# EAGLE design main (EAGLE 9.5.2)

## Sheet 1 of 3: Arduino and UI
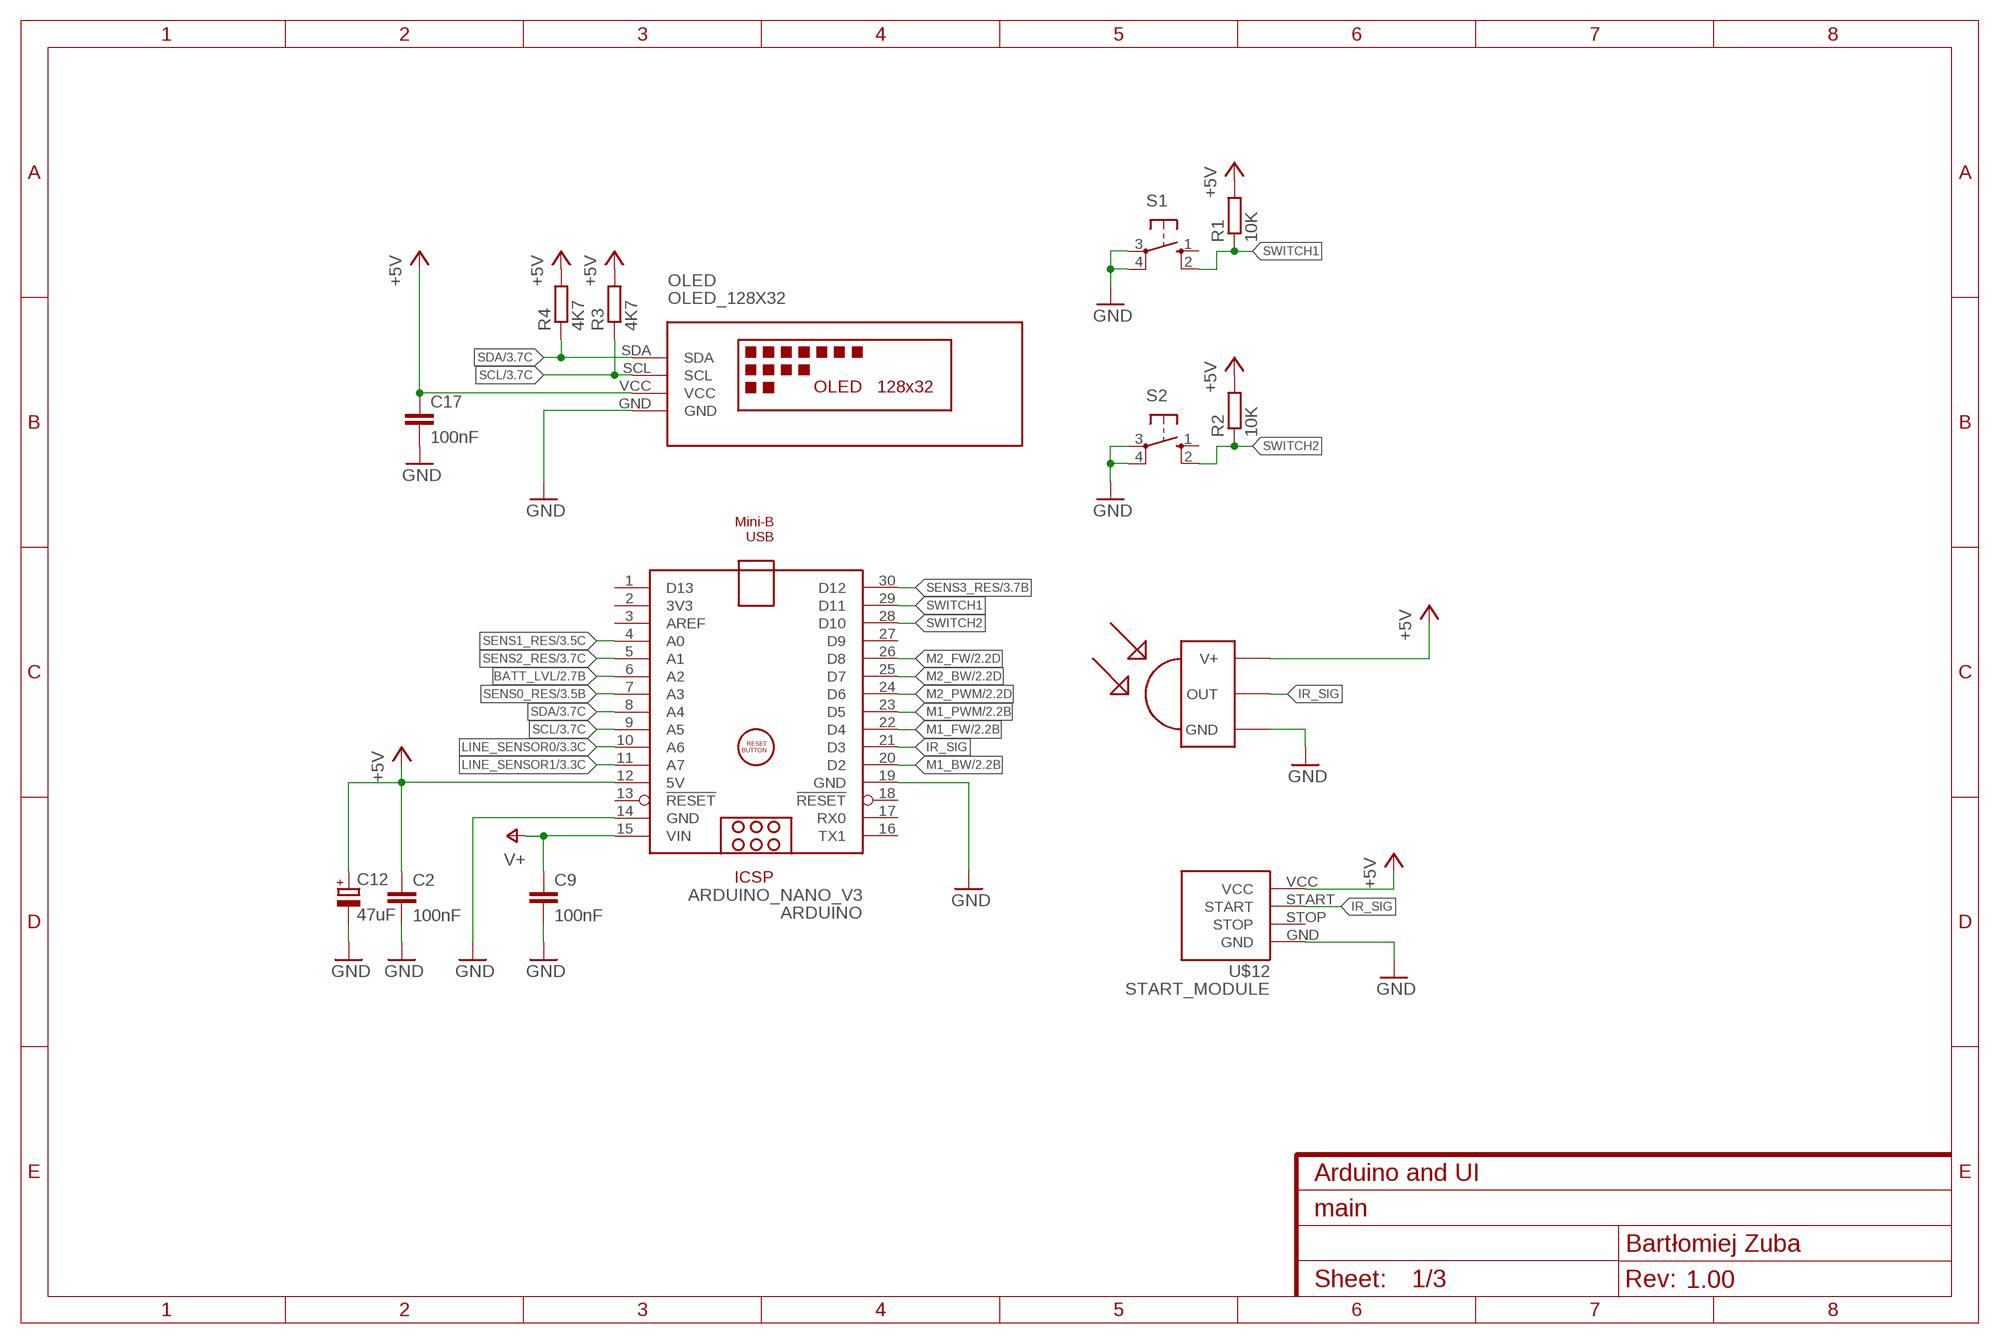
[diagram p0: schematic, sheet 1]
FRAME4 (FRAME-A4L): CNAME: Arduino and UI; CREVISION: 1.00; DESIGNER: Bartłomiej Zuba

### Parts
ARDUINO  ARDUINO_NANO_V3  [ARDUINO_NANO_V3]
C2  100nF  C-EUC0805  [C0805]
C9  100nF  C-EUC0805  [C0805]
C12  47uF  CPOL-EUE3.5-8  [E3,5-8]
C17  100nF  C-EUC0805  [C0805]
OLED  OLED_128X32  [OLED]
R1  10K  R-EU_M0805  [M0805]
R2  10K  R-EU_M0805  [M0805]
R3  4K7  R-EU_M0805  [M0805]
R4  4K7  R-EU_M0805  [M0805]
S1  10-XX  [B3F-10XX]
S2  10-XX  [B3F-10XX]
U$2  TSOP4838  [TSOP]
U$12  START_MODULE  [START_MODULE]

### Nets
+5V: ARDUINO.12(5V) C2.1 C12.+ C17.1 OLED.VCC R1.2 R2.2 R3.2 R4.2 U$2.VCC(V+) U$12.VCC ; also sheet 2,3
BATT_LVL: ARDUINO.6(A2) ; also sheet 2
GND: ARDUINO.14(GND) ARDUINO.19(GND) C2.2 C9.2 C12.- C17.2 OLED.GND S1.3(P) S1.4(P1) S2.3(P) S2.4(P1) U$2.GND U$12.GND ; also sheet 2,3
IR_SIG: ARDUINO.21(D3) U$2.OUT U$12.START
LINE_SENSOR0: ARDUINO.10(A6) ; also sheet 3
LINE_SENSOR1: ARDUINO.11(A7) ; also sheet 3
M1_BW: ARDUINO.20(D2) ; also sheet 2
M1_FW: ARDUINO.22(D4) ; also sheet 2
M1_PWM: ARDUINO.23(D5) ; also sheet 2
M2_BW: ARDUINO.25(D7) ; also sheet 2
M2_FW: ARDUINO.26(D8) ; also sheet 2
M2_PWM: ARDUINO.24(D6) ; also sheet 2
SCL: ARDUINO.9(A5) OLED.SCL R3.1 ; also sheet 3
SDA: ARDUINO.8(A4) OLED.SDA R4.1 ; also sheet 3
SENS0_RES: ARDUINO.7(A3) ; also sheet 3
SENS1_RES: ARDUINO.4(A0) ; also sheet 3
SENS2_RES: ARDUINO.5(A1) ; also sheet 3
SENS3_RES: ARDUINO.30(D12) ; also sheet 3
SWITCH1: ARDUINO.29(D11) R1.1 S1.2(S1)
SWITCH2: ARDUINO.28(D10) R2.1 S2.2(S1)
V+: ARDUINO.15(VIN) C9.1 ; also sheet 2
Unconnected: ARDUINO.1(D13) ARDUINO.2(3V3) ARDUINO.3(AREF) ARDUINO.13(!RESET) ARDUINO.16(TX1) ARDUINO.17(RX0) ARDUINO.18(!RESET) ARDUINO.27(D9) S1.1(S) S2.1(S) U$12.STOP

## Sheet 2 of 3: POWER AND H BRIDGES
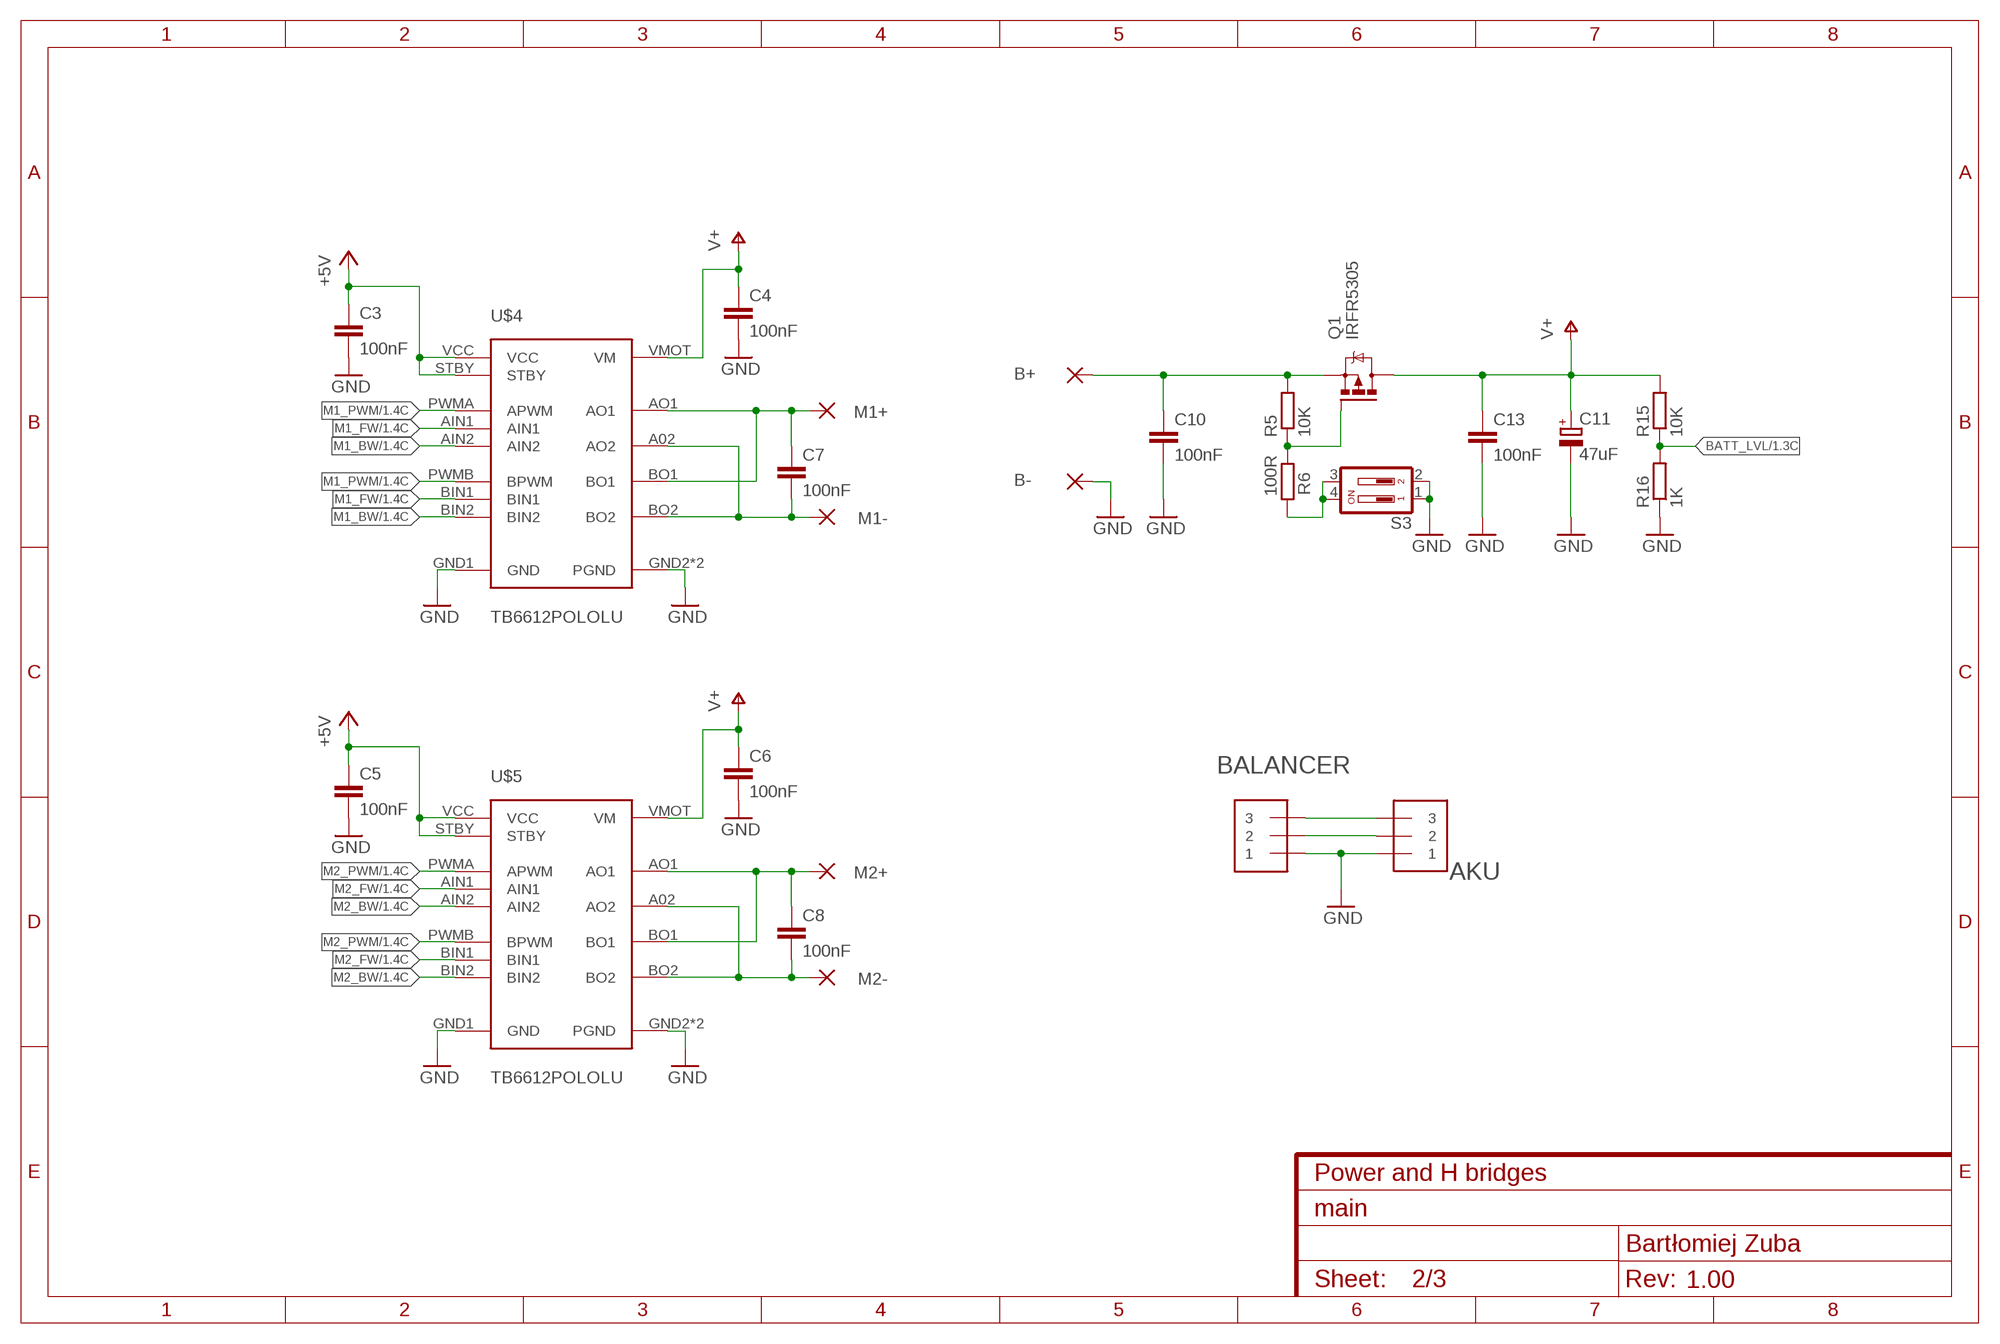
[diagram p1: schematic, sheet 2]
FRAME2 (FRAME-A4L): CNAME: Power and H bridges; CREVISION: 1.00; DESIGNER: Bartłomiej Zuba

### Parts
AKU  JST_ZH_3  [JST_ZH_3]
B+  2,54/1,0  [2,54/1,0]
B-  2,54/1,0  [2,54/1,0]
BALANCER  JST_ZH_3  [JST_ZH_3]
C3  100nF  C-EUC0805  [C0805]
C4  100nF  C-EUC0805  [C0805]
C5  100nF  C-EUC0805  [C0805]
C6  100nF  C-EUC0805  [C0805]
C7  100nF  C-EUC0805  [C0805]
C8  100nF  C-EUC0805  [C0805]
C10  100nF  C-EUC0805  [C0805]
C11  47uF  CPOL-EUE3.5-8  [E3,5-8]
C13  100nF  C-EUC0805  [C0805]
M1+  2,54/1,0  [2,54/1,0]
M1-  2,54/1,0  [2,54/1,0]
M2+  2,54/1,0  [2,54/1,0]
M2-  2,54/1,0  [2,54/1,0]
Q1  IRFR5305  [D-PAK_TO252AA]
R5  10K  R-EU_M0805  [M0805]
R6  100R  R-EU_M0805  [M0805]
R15  10K  R-EU_M0805  [M0805]
R16  1K  R-EU_M0805  [M0805]
S3  DS02  [DS-02]
U$4  TB6612POLOLU  [POLOLU]
U$5  TB6612POLOLU  [POLOLU]

### Nets
+5V: C3.1 C5.1 U$4.STBY U$4.VCC U$5.STBY U$5.VCC ; also sheet 1,3
BATT_LVL: R15.1 R16.2 ; also sheet 1
GND: AKU.P$1 B-.1(P) BALANCER.P$1 C3.2 C4.2 C5.2 C6.2 C10.2 C11.- C13.2 R16.1 S3.1 S3.2 U$4.GND1(GND) U$4.GND2(PGND) U$4.GND3(PGND) U$5.GND1(GND) U$5.GND2(PGND) U$5.GND3(PGND) ; also sheet 1,3
M1_BW: U$4.AIN2 U$4.BIN2 ; also sheet 1
M1_FW: U$4.AIN1 U$4.BIN1 ; also sheet 1
M1_PWM: U$4.PWMA(APWM) U$4.PWMB(BPWM) ; also sheet 1
M2_BW: U$5.AIN2 U$5.BIN2 ; also sheet 1
M2_FW: U$5.AIN1 U$5.BIN1 ; also sheet 1
M2_PWM: U$5.PWMA(APWM) U$5.PWMB(BPWM) ; also sheet 1
N$1: C7.1 M1+.1(P) U$4.AO1 U$4.BO1
N$2: C7.2 M1-.1(P) U$4.A02(AO2) U$4.BO2
N$3: C8.1 M2+.1(P) U$5.AO1 U$5.BO1
N$4: C8.2 M2-.1(P) U$5.A02(AO2) U$5.BO2
N$5: Q1.1(G) R5.1 R6.1
N$6: R6.2 S3.3 S3.4
N$19: AKU.P$2 BALANCER.P$2
N$20: B+.1(P) C10.1 Q1.3(S) R5.2
N$21: AKU.P$3 BALANCER.P$3
V+: C4.1 C6.1 C11.+ C13.1 Q1.4(D) R15.2 U$4.VMOT(VM) U$5.VMOT(VM) ; also sheet 1

## Sheet 3 of 3: RANGE SENSORS
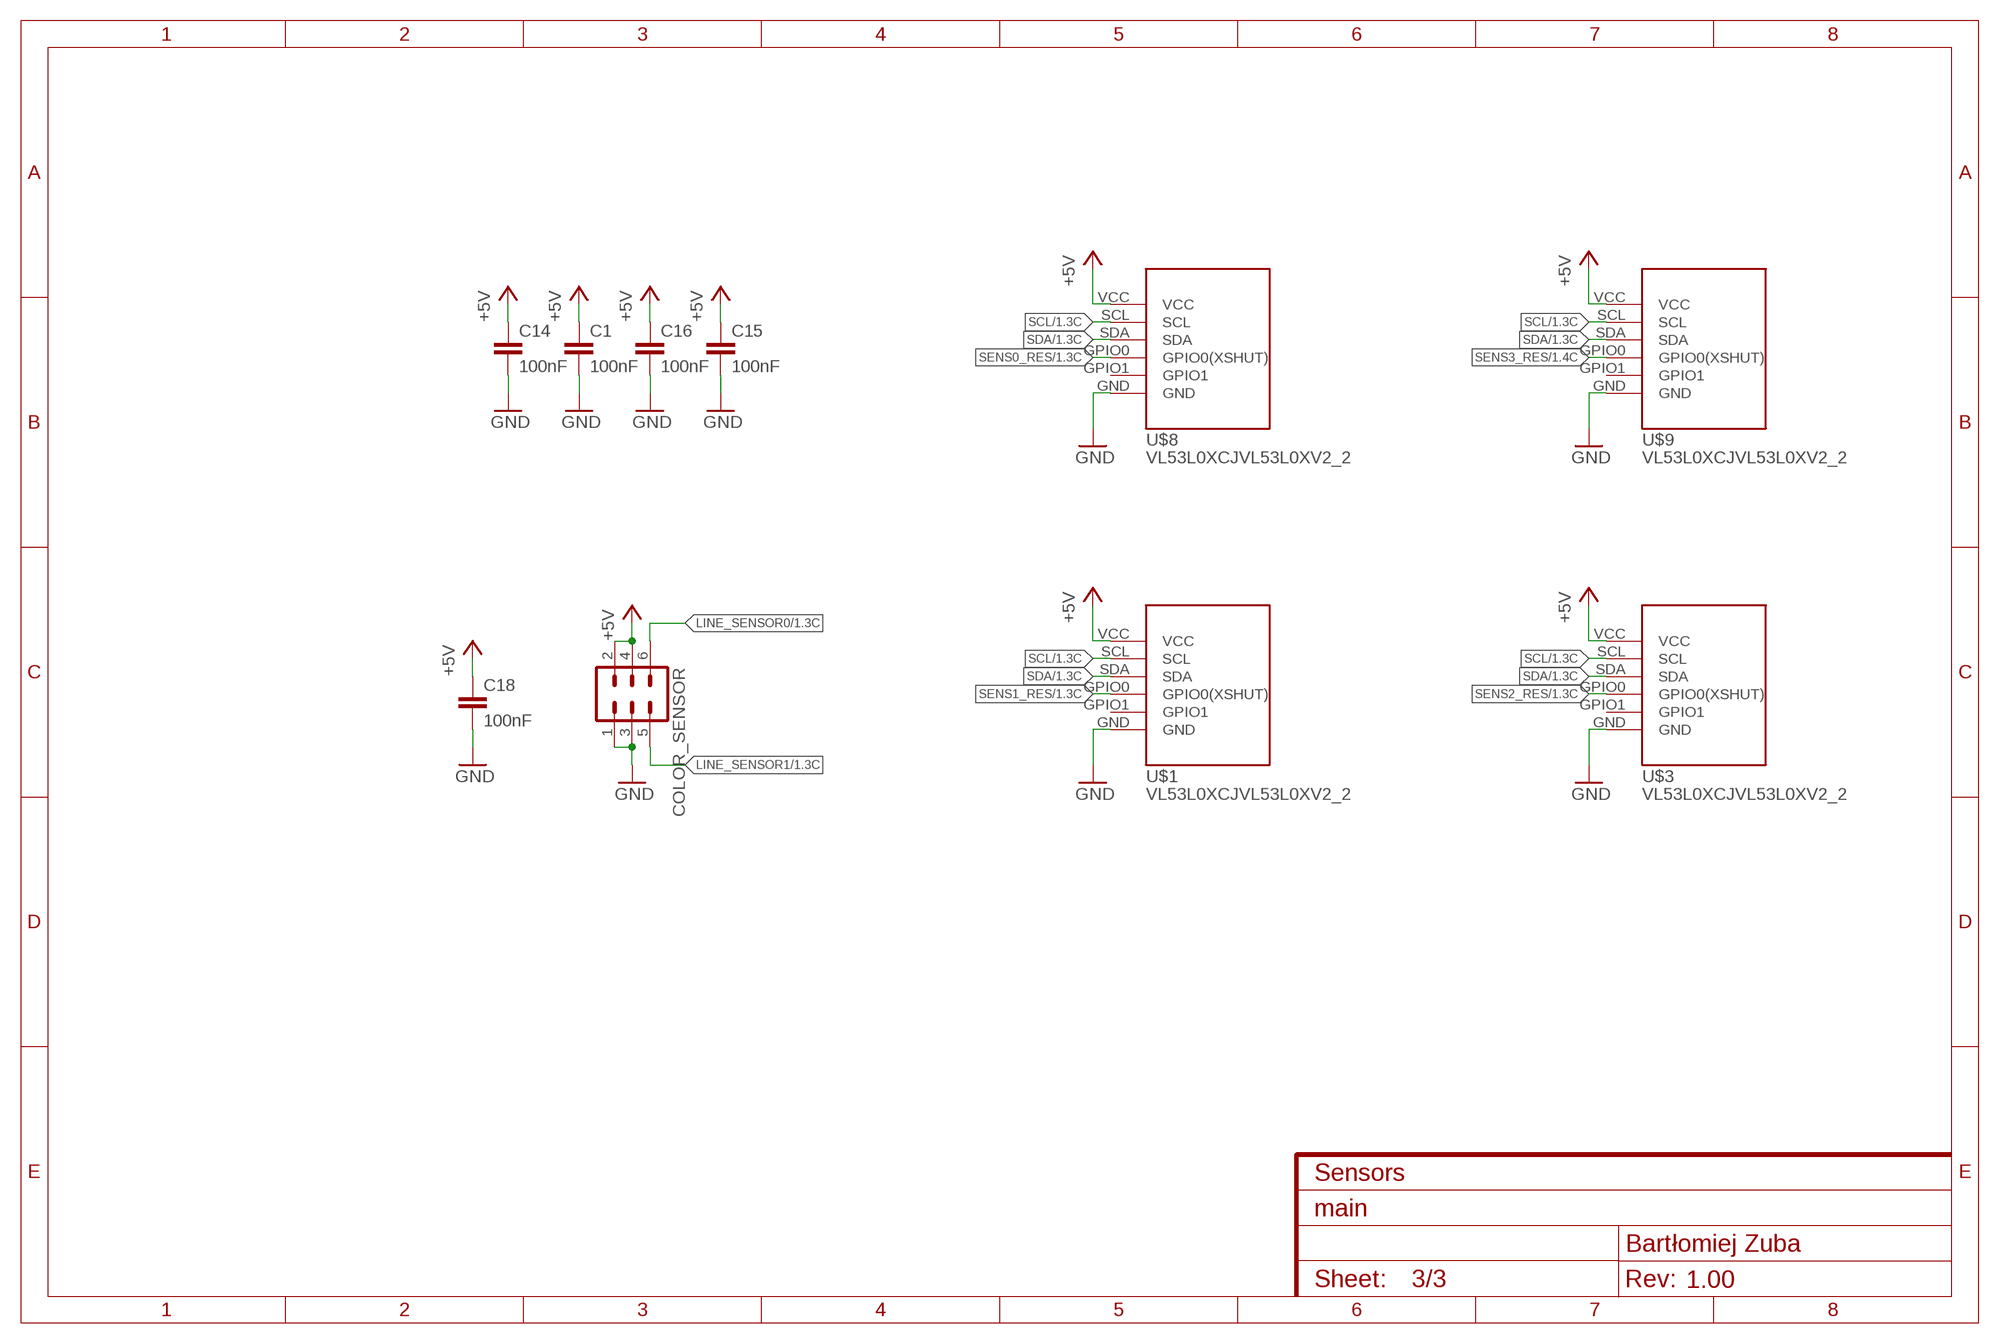
[diagram p2: schematic, sheet 3]
FRAME3 (FRAME-A4L): CNAME: Sensors; CREVISION: 1.00; DESIGNER: Bartłomiej Zuba

### Parts
C1  100nF  C-EUC0805  [C0805]
C14  100nF  C-EUC0805  [C0805]
C15  100nF  C-EUC0805  [C0805]
C16  100nF  C-EUC0805  [C0805]
C18  100nF  C-EUC0805  [C0805]
COLOR_SENSOR  MA03-2  [MA03-2]
U$1  VL53L0XCJVL53L0XV2_2  [VL53L0X_4]
U$3  VL53L0XCJVL53L0XV2_2  [VL53L0X_4]
U$8  VL53L0XCJVL53L0XV2_2  [VL53L0X_4]
U$9  VL53L0XCJVL53L0XV2_2  [VL53L0X_4]

### Nets
+5V: C1.1 C14.1 C15.1 C16.1 C18.1 COLOR_SENSOR.2 COLOR_SENSOR.4 U$1.VCC U$3.VCC U$8.VCC U$9.VCC ; also sheet 1,2
GND: C1.2 C14.2 C15.2 C16.2 C18.2 COLOR_SENSOR.1 COLOR_SENSOR.3 U$1.GND U$3.GND U$8.GND U$9.GND ; also sheet 1,2
LINE_SENSOR0: COLOR_SENSOR.6 ; also sheet 1
LINE_SENSOR1: COLOR_SENSOR.5 ; also sheet 1
SCL: U$1.SCL U$3.SCL U$8.SCL U$9.SCL ; also sheet 1
SDA: U$1.SDA U$3.SDA U$8.SDA U$9.SDA ; also sheet 1
SENS0_RES: U$8.GPIO0(GPIO0(XSHUT)) ; also sheet 1
SENS1_RES: U$1.GPIO0(GPIO0(XSHUT)) ; also sheet 1
SENS2_RES: U$3.GPIO0(GPIO0(XSHUT)) ; also sheet 1
SENS3_RES: U$9.GPIO0(GPIO0(XSHUT)) ; also sheet 1
Unconnected: U$1.GPIO1 U$3.GPIO1 U$8.GPIO1 U$9.GPIO1

## Library data of the parts
AKU BALANCER = BeagleBone_Blue_R3:JST_ZH_3
ARDUINO = ZUBA_MINISUMO:ARDUINO_NANO_V3
B+ B- M1+ M1- M2+ M2- = wirepad:2,54/1,0: THROUGH-HOLE PAD
C1-C10 C13-C18 = rcl:C-EU: CAPACITOR, European symbol; SPICEPREFIX: C
C11 C12 = rcl:CPOL-EU: POLARIZED CAPACITOR, European symbol; SPICEPREFIX: C
COLOR_SENSOR = con-lstb:MA03-2: PIN HEADER; OC_FARNELL: unknown; OC_NEWARK: unknown
OLED = ZUBA_MINISUMO:OLED_128X32
Q1 = transistor-power:IRF?5305: HEXFET Power MOSFET Source: http://www.irf.com/product-info/datasheets/data/irfr5305pbf.pdf
R1-R6 R15 R16 = rcl:R-EU_: RESISTOR, European symbol; SPICEPREFIX: R
S1 S2 = switch-omron:10-XX: OMRON SWITCH; MPN: B3F-1000; OC_FARNELL: 176432; OC_NEWARK: 36M3542
S3 = switch-dil:DS02: DIL/CODE SWITCH; OC_FARNELL: 9472126; OC_NEWARK: unknown
U$1 U$3 U$8 U$9 = ZUBA_MINISUMO:VL53L0X
U$2 = ZUBA_MINISUMO:TSOP4838
U$4 U$5 = ZUBA_MINISUMO:TB6612
U$12 = ZUBA_MINISUMO:START_MODULE

## Board
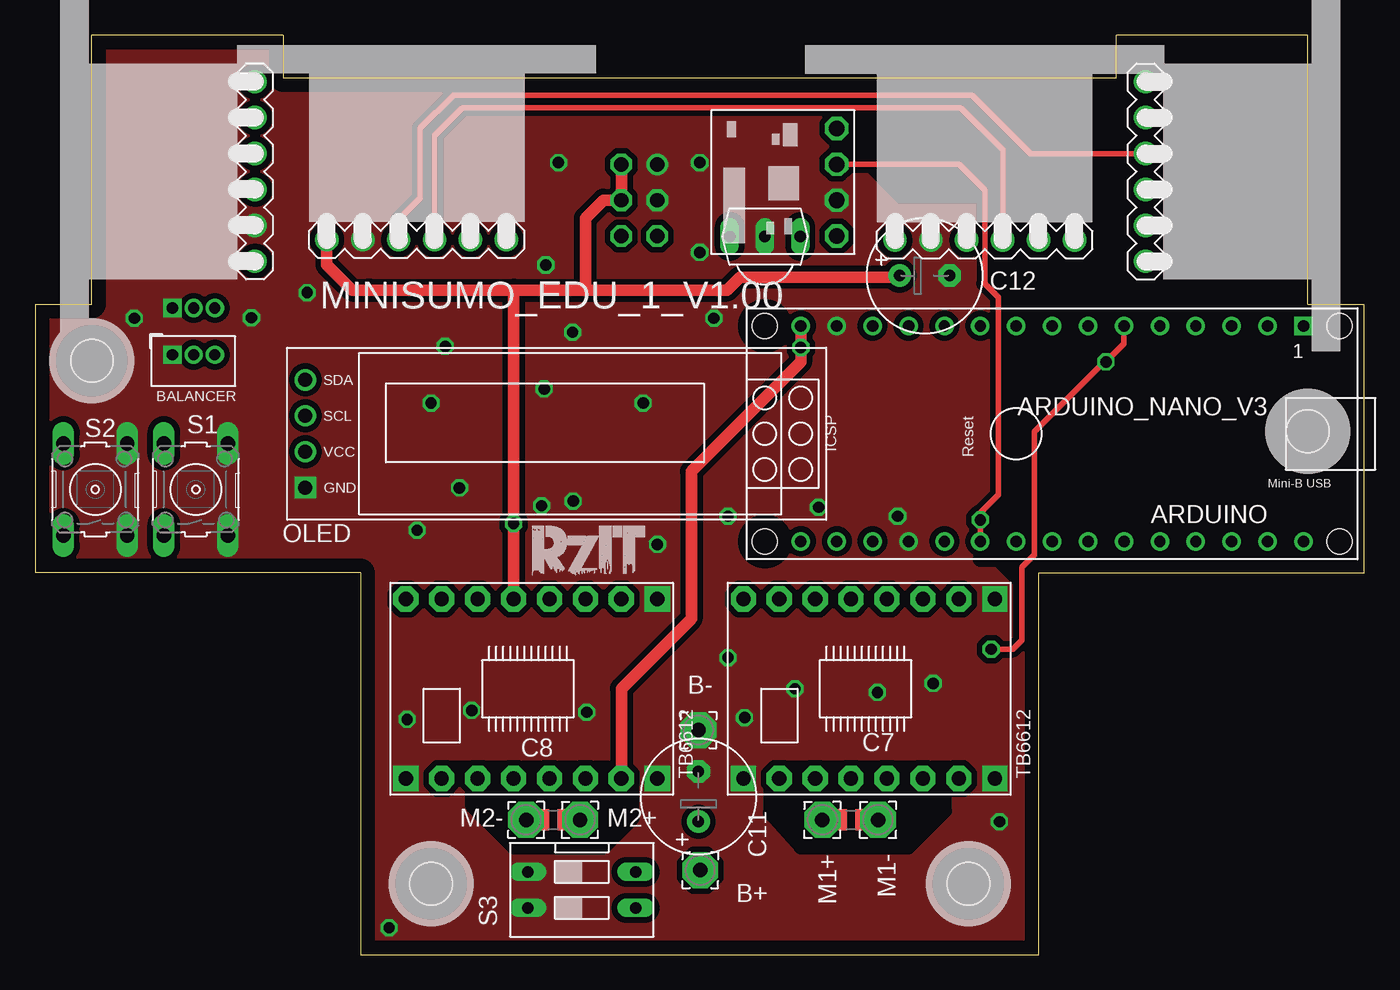
[diagram p3: board, top side]
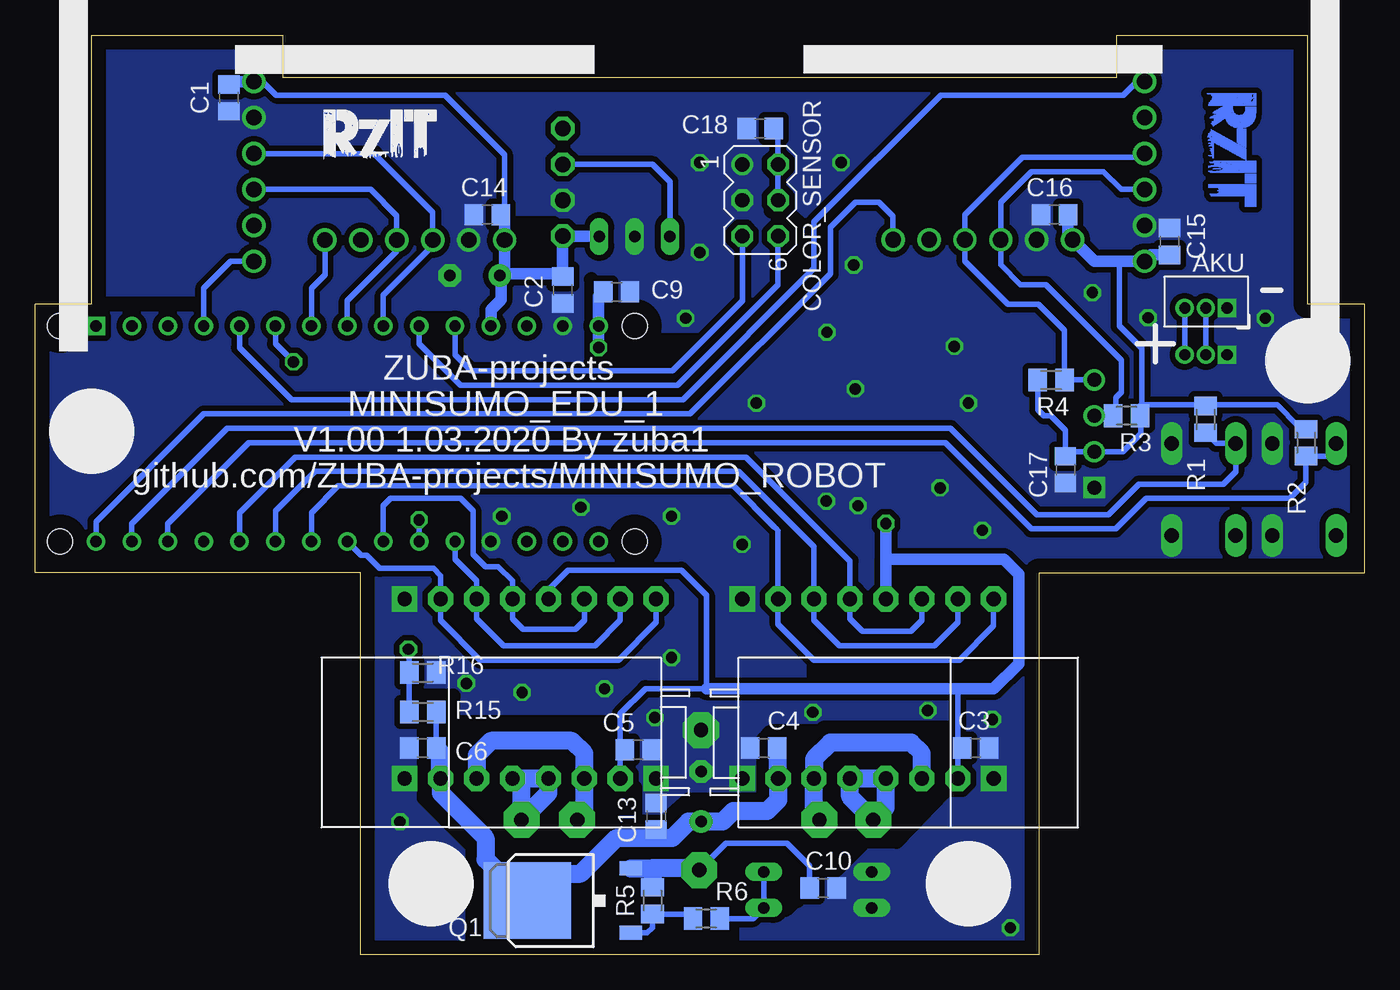
[diagram p4: board, bottom side, seen from below]

Size 94 x 65 mm. Coordinates in mm from the lower left corner, seen from the top.
Outline: 17.54,65 4,65 4,46 0,46 0,27 23,27 23,0 71,0 71,27 94,27 94,46 90,46 90,65 76.46,65 76.46,62 17.54,62 17.54,65
Copper layers (1*16): Top 0.035mm / dielectric 1.5mm / Bottom 0.035mm
Design rules "default": minimum track width 6mil, minimum drill 0.35mm, track to track 6mil, track to pad 6mil, pad to pad 6mil, via to via 6mil, smd to smd 6mil, copper to edge 40mil, drill to drill 6mil, minimum pad ring 10mil, minimum via ring 8mil, stop-mask expansion 4mil, vias tented up to drill 0mil, thermal gap 10mil
Holes 3 mm at 28,5 66,5 4,42 90,37
tRestrict: 14 lines
bRestrict: 29 lines

### Footprints (pad centres in the part's own frame; a part is rotated, then mirrored left to right if it is on the bottom)
JST_ZH_3 = drill 0.787 square: P$1 0,0 | drill 0.787: P$2 1.499,0; P$3 2.997,0
ARDUINO_NANO_V3 = drill 0.8 square: 1 -20.32,-7.62 | drill 0.8: 2 -17.78,-7.62; 3 -15.24,-7.62; 4 -12.7,-7.62; 5 -10.16,-7.62; 6 -7.62,-7.62; 7 -5.08,-7.62; 8 -2.54,-7.62; 9 0,-7.62; 10 2.54,-7.62; 11 5.08,-7.62; 12 7.62,-7.62; 13 10.16,-7.62; 14 12.7,-7.62; 15 15.24,-7.62; 16 15.24,7.62; 17 12.7,7.62; 18 10.16,7.62; 19 7.62,7.62; 20 5.08,7.62; 21 2.54,7.62; 22 0,7.62; 23 -2.54,7.62; 24 -5.08,7.62; 25 -7.62,7.62; 26 -10.16,7.62; 27 -12.7,7.62; 28 -15.24,7.62; 29 -17.78,7.62; 30 -20.32,7.62 | hole 1.778: -22.86,-7.62; -22.86,7.62; 17.78,7.62; 17.78,-7.62
2,54/1,0 = drill 1.016 pad 2.54 octagon: 1 0,0
C0805 = smd 1.3 x 1.5: 1 -0.95,0; 2 0.95,0
E3,5-8 = drill 0.813 pad 1.6: + -1.778,0 | drill 0.813 pad 1.6 octagon: - 1.778,0
MA03-2 = drill 1.016: 1 -2.54,-1.27 | drill 1.016 octagon: 2 -2.54,1.27; 3 0,-1.27; 4 0,1.27; 5 2.54,-1.27; 6 2.54,1.27
OLED = drill 1 square: GND -17.78,-3.81 | drill 1: SCL -17.78,1.27; SDA -17.78,3.81; VCC -17.78,-1.27
D-PAK_TO252AA = smd 1 x 1.6: 1 -2.28,-4.8; 3 2.28,-4.8 | smd 5.4 x 6.2: 4 0,2.5
M0805 = smd 1.3 x 1.6: 1 -0.95,0; 2 0.95,0
B3F-10XX = drill 1.016 long: 1 -3.251,2.261; 2 3.251,2.261; 3 -3.251,-2.261; 4 3.251,-2.261
DS-02 = drill 0.813 long: 1 -1.27,-3.81; 2 1.27,-3.81; 3 1.27,3.81; 4 -1.27,3.81
VL53L0X_4 = drill 1.1: GND -3.81,0; GPIO0 6.35,0; GPIO1 3.81,0; SCL -1.27,0; SDA 1.27,0; VCC -6.35,0
TSOP = drill 0.813 long: GND -0.001,-0.027; OUT -2.501,-0.027; VCC 2.499,-0.027
POLOLU = drill 1 pad 1.778 octagon: A02 -1.27,-6.35; AIN1 -3.81,6.35; AIN2 -6.35,6.35; AO1 -3.81,-6.35; BIN1 1.27,6.35; BIN2 3.81,6.35; BO1 3.81,-6.35; BO2 1.27,-6.35; PWMA -8.89,6.35; PWMB 6.35,6.35; STBY -1.27,6.35; VCC -6.35,-6.35; VMOT 6.35,-6.35 | drill 1 pad 1.778 square: GND1 -8.89,-6.35; GND2 8.89,-6.35; GND3 8.89,6.35
START_MODULE = drill 1.1 octagon: GND 2.54,0; START 5.08,0; STOP 7.62,0; VCC 0,0

### Placement (x,y rotation side)
AKU  9.7,45.72 180 bottom
ARDUINO  69.39,36.83 180 top
B+  47.04,5.97 0 top
B-  46.91,15.88 0 top
BALANCER  9.7,42.42 0 top
C1  80.31,60.58 270 bottom
C2  56.69,46.99 270 bottom
C3  27.48,14.61 0 bottom
C4  42.47,14.61 180 bottom
C5  51.36,14.48 0 bottom
C6  66.6,14.61 180 bottom
C7  57.71,9.53 0 top
C8  36.62,9.53 180 top
C9  52.88,46.86 0 bottom
C10  38.27,4.7 0 bottom
C11  46.91,11.18 90 top
C12  62.91,48.01 0 top
C13  50.09,9.78 90 bottom
C14  62.02,52.32 180 bottom
C15  13.76,50.42 90 bottom
C16  21.89,52.32 180 bottom
C17  21.13,34.29 270 bottom
C18  42.72,58.42 180 bottom
COLOR_SENSOR  42.72,53.34 270 bottom
M1+  55.67,9.53 0 top
M1-  59.61,9.53 0 top
M2+  38.53,9.53 0 top
M2-  34.72,9.53 0 top
OLED  36.88,36.83 0 top
Q1  56.69,3.81 90 bottom
R1  11.22,37.85 90 bottom
R2  4.11,36.2 90 bottom
R3  16.81,38.1 0 bottom
R4  22.15,40.64 180 bottom
R5  50.34,3.81 90 bottom
R6  46.53,2.54 0 bottom
R15  66.6,17.14 0 bottom
R16  66.6,19.94 180 bottom
S1  11.35,32.89 90 top
S2  4.24,32.89 90 top
S3  38.66,4.57 270 top
U$1  78.53,55.37 270 top
U$2  51.61,50.8 0 top
U$3  15.54,55.37 90 top
U$4  58.98,18.8 0 top
U$5  35.1,18.8 0 top
U$6  [POLOLU_HP]  25,15 90 bottom
U$7  [POLOLU_HP]  69,15 270 bottom
U$8  67.16,50.52 0 top
U$9  26.97,50.55 0 top
U$12  56.69,50.8 90 top

### Tracks (layer width: path | path; a pad name or v marks a point on that pad's centre or on a via)
+5V  (via drill 0.8)
  Top 0.813: 33.83,46.99 23.67,46.99 23.54,46.99 22.4,46.99 20.62,48.77 U$9.VCC | 33.83,46.99 38.91,46.99 | 38.91,46.99 48.94,46.99 49.83,47.88 61.01,47.88 C12.+ | 38.91,46.99 38.91,52.07 40.18,53.34 COLOR_SENSOR.4 COLOR_SENSOR.2 | 33.83,46.99 v33.83,30.48 U$5.STBY
  Bottom 0.406: U$2.VCC 54.13,50.8 | C12.+ 61.06,47.93 | U$4.STBY 57.71,25.78 56.31,27.18 48.31,27.18 46.53,25.4 46.53,18.8 50.85,18.8 52.63,17.02 52.63,14.35 | U$5.VCC 28.75,14.48 | 28.75,14.48 28.75,18.8 | 52.63,14.35 U$4.VCC | 56.69,48.13 56.82,48.01 56.76,48.01 C2.1 | 61.01,48.13 C12.+ | C5.1 52.5,14.48 52.63,14.35 | C3.1 28.62,14.61 28.75,14.48 | 15.8,38.03 15.8,36.83 17.07,35.56 OLED.VCC 20.81,35.56 C17.1 21.13,37.08 22.15,38.1 22.65,38.1 23.1,38.54 R4.2 | 15.8,38.03 15.8,38.86 11.29,38.86 | 11.29,38.86 6.14,38.86 4.68,37.4 4.62,37.4 4.37,37.15 R2.2 | R1.2 11.29,38.86 | 15.8,38.03 R3.2 15.73,38.23 15.73,42.87 17.32,44.45 17.32,49.02 | 80.05,61.8 C1.1 | 14.14,49.09 C15.1 14.08,49.15 | COLOR_SENSOR.4 COLOR_SENSOR.2 41.45,58.1 C18.1 | 79.99,61.85 C1.1 | 20.57,51.95 C16.1 20.62,52 | 20.94,50.87 U$9.VCC | 80.12,61.72 C1.1 | U$1.VCC 77.91,61.72 76.97,60.78 65.02,60.78 60.81,56.57 60.81,52.06 | C12.+ 60.81,48.33
  Bottom 0.813: 54.13,50.8 U$12.VCC 56.69,48.13 61.01,48.13 | 61.06,47.93 61.06,46.3 61.77,45.59 ARDUINO.12 | 33.83,27.81 33.7,27.94 25.49,27.94 24.43,26.88 24.43,20.57 26.21,18.8 28.75,18.8 46.53,18.8 | C14.1 60.81,52.06 U$8.VCC 60.81,48.33 | v33.83,30.48 33.83,27.81 | U$5.STBY 33.83,27.81 | U$9.VCC 19.1,49.02 17.32,49.02 U$3.VCC 15.09,49.47 C15.1 | C16.1 20.94,50.87 | U$1.VCC 80.12,61.72
BATT_LVL  (via drill 0.8)
  Top 0.406: v67.61,21.59 69.14,21.59 69.78,22.23 69.78,27.38 70.62,28.22 70.66,28.22 70.66,36.96 75.61,41.91 v75.74,41.91 77.01,43.18 ARDUINO.6
  Bottom 0.406: R15.1 R16.2 67.55,21.52 v67.61,21.59 | ARDUINO.6 77.01,43.18 v75.74,41.91
GND  (via drill 0.8)
  other vias: 49,31 49,21 44,29 38.05,32.07 35.81,31.73 43,39 38,44 36,40 29,43 28,39 30,33 27,30 7,45 47,56 48,45 37,56 61,31 47,49.65 63.51,19.17 59.57,18.54 53.73,18.79 50.17,16.76 39,17.14 30.87,17.27 26.3,16.63 25.03,1.9 68.21,9.39 55.41,31.64 15.29,45.03 36.11,48.76 19.22,46.81
  pour Bottom (isolate 0.406, no thermals): 3.35,64.77 17.32,64.77 17.32,62.23 75.74,62.23 75.74,66.04 90.98,66.04 90.98,46.99 94.79,46.99 94.79,25.4 71.93,25.4 71.93,0 22.4,0 22.4,26.67 -0.46,26.67 -0.46,46.99 3.35,46.99
  pour Top (isolate 0.406, no thermals): 23,0 23,27 0,27 0,47.27 4,47.27 4,65 18,65 18,62 57,62 58,61 58,56 61,53 68,53 68,31 71,28 71,0
IR_SIG  (via drill 0.8)
  Top 0.406: ARDUINO.21 v66.85,30.73 66.85,31.24 68.12,32.51 68.12,46.48 67.16,47.44 67.16,54.05 65.33,55.88 U$12.START
  Bottom 0.406: U$2.OUT 49.11,54.65 50.34,55.88 U$12.START | v66.85,30.73 ARDUINO.21
LINE_SENSOR0
  Bottom 0.406: ARDUINO.10 66.85,43.18 63.93,40.26 48.56,40.26 41.45,47.37 COLOR_SENSOR.6
LINE_SENSOR1
  Bottom 0.406: ARDUINO.11 64.31,42.42 63.17,41.27 48.94,41.27 43.99,46.23 COLOR_SENSOR.5
M1_BW
  Bottom 0.406: U$4.AIN2 52.63,23.62 54.4,21.84 60.88,21.84 62.79,23.75 U$4.BIN2 62.79,26.42 64.31,27.94 ARDUINO.20
M1_FW
  Bottom 0.406: U$4.AIN1 55.17,23.62 55.8,22.99 59.48,22.99 60.25,23.75 U$4.BIN1 60.25,26.42 61.26,27.43 62.15,27.43 63.04,28.32 63.04,31.37 63.93,32.26 68.88,32.26 69.39,31.75 ARDUINO.22
M1_PWM
  Bottom 0.406: U$4.PWMA 50.09,23.5 52.75,20.83 62.53,20.83 65.33,23.62 U$4.PWMB 65.33,26.8 65.83,27.3 69.64,27.3 70.56,28.22 70.94,28.22 ARDUINO.23
M2_BW
  Bottom 0.406: U$5.AIN2 28.75,23.5 30.4,21.84 37.13,21.84 38.91,23.62 U$5.BIN2 38.91,28.83 39.04,28.96 39.1,29.02 44.24,34.16 74.22,34.16 77.01,31.37 ARDUINO.25
M2_FW
  Bottom 0.406: U$5.AIN1 31.29,23.62 32.05,22.86 35.48,22.86 36.37,23.75 U$5.BIN1 36.37,27.81 43.74,35.18 75.61,35.18 79.55,31.24 ARDUINO.26
M2_PWM
  Bottom 0.406: U$5.PWMA 26.21,23.24 28.62,20.83 38.91,20.83 41.45,23.37 U$5.PWMB 41.45,29.97 41.58,30.1 41.7,30.23 44.62,33.15 72.56,33.15 74.47,31.24 ARDUINO.24
N$1
  Top 0.406: C7.1 M1+.1
  Bottom 1.27: U$4.BO1 62.79,14.1 61.77,15.11 56.05,15.11 55.17,14.22 U$4.AO1 55.17,10.03 M1+.1
N$2
  Top 0.406: C7.2 M1-.1
  Bottom 1.27: M1-.1 59.61,11.81 U$4.BO2 U$4.A02 57.71,11.43 M1-.1
N$3
  Top 0.406: C8.1 M2+.1
  Bottom 1.27: U$5.AO1 31.29,14.22 32.05,14.99 37.77,14.99 38.91,13.84 U$5.BO1 38.91,9.91 M2+.1
N$4
  Top 0.406: C8.2 M2-.1
  Bottom 1.27: U$5.A02 U$5.BO2 36.37,11.18 M2-.1 33.83,10.41 U$5.A02
N$5
  Bottom 0.406: R6.1 47.8,2.86 R5.1 50.34,1.91 50.72,1.52 Q1.1
N$6
  Bottom 0.406: R6.2 43.23,2.54 S3.3 S3.4
N$19
  Bottom 0.406: BALANCER.P$2 AKU.P$2
N$20
  Bottom 0.406: 50.46,6.09 50.34,5.97 | 47.16,6.09 B+.1 45.13,7.87 40.81,7.87 39.23,6.28 C10.1
  Bottom 1.27: Q1.3 50.46,6.09 47.16,6.09 | 50.34,5.97 R5.2
N$21
  Bottom 0.406: AKU.P$3 BALANCER.P$3
SCL
  Top 0.406: U$1.SCL 70.41,56.64 66.27,60.78 29.59,60.78 27.23,58.42 27.23,53.47 25.7,51.94 U$9.SCL
  Bottom 0.406: OLED.SCL R3.1 17.57,38.29 17.57,39.37 17.19,39.75 17.19,42.04 22.53,47.37 24.3,47.37 25.7,48.77 U$9.SCL 25.7,53.21 23.54,55.37 18.46,55.37 17.19,54.1 U$3.SCL | ARDUINO.9 69.39,46.61 65.89,50.11 U$8.SCL 65.89,52.51 70.03,56.64 U$1.SCL
SDA
  Top 0.406: U$8.SDA 68.43,56.92 65.45,59.89 30.22,59.89 28.24,57.91 U$9.SDA
  Bottom 0.406: U$3.SDA 15.8,56.39 24.18,56.39 28.24,52.32 U$9.SDA 28.24,49.02 25.19,45.97 23.04,45.97 21.2,44.13 R4.1 OLED.SDA | ARDUINO.8 71.93,46.23 68.43,49.73 U$8.SDA 68.43,52.25 70.28,54.1 U$1.SDA
SENS0_RES
  Bottom 0.406: U$8.GPIO0 73.51,48.08 74.47,47.12 ARDUINO.7
SENS1_RES
  Bottom 0.406: ARDUINO.4 82.09,47.12 80.19,49.02 U$1.GPIO0
SENS2_RES
  Bottom 0.406: ARDUINO.5 79.55,42.93 75.87,39.24 48.18,39.24 38.91,48.51 38.91,51.82 29.95,60.78 17.04,60.78 16.09,61.72 U$3.GPIO0
SENS3_RES
  Bottom 0.406: ARDUINO.30 89.71,30.61 82.09,38.23 47.67,38.23 37.77,48.13 37.77,51.44 35.99,53.21 34.34,53.21 33.32,52.2 U$9.GPIO0
SWITCH1
  Bottom 0.406: R1.1 10.47,36.14 S1.2 9.09,34.14 9.95,33.27 15.92,33.27 18.08,31.11 23.16,31.11 29.26,37.21 80.44,37.21 87.17,30.48 ARDUINO.29
SWITCH2
  Bottom 0.406: S2.2 1.98,35.53 2.27,35.24 R2.1 4.11,33.4 5.26,32.26 15.41,32.26 17.57,30.1 23.54,30.1 29.64,36.2 78.92,36.2 84.63,30.48 ARDUINO.28
V+  (via drill 0.8)
  Top 0.813: U$5.VMOT 41.45,18.8 46.4,23.75 46.4,34.16 54.15,41.91 v54.15,42.93 ARDUINO.15
  Bottom 0.406: 57.28,5.71 Q1.4 59.23,3.81 | 41.52,12.51 U$5.VMOT | 65.26,12.51 U$4.VMOT | C13.1 50.21,8.7 50.21,8.26 | C6.1 R15.2
  Bottom 0.813: C9.1 54.15,46.54 ARDUINO.15 v54.15,42.93
  Bottom 1.27: U$5.VMOT 41.45,10.92 42.21,10.16 44.62,10.16 45.39,9.4 C11.+ 47.8,9.4 48.94,8.26 50.21,8.26 52.88,8.26 55.42,5.71 57.28,5.71 | U$4.VMOT 65.33,11.43 62.15,8.26 62.15,6.73 59.23,3.81 | C4.1 41.52,12.51 | C6.1 65.39,14.35 65.39,12.64 65.26,12.51
(copper drawn outside any net)
  shapes: Bottom area x1254

### Text on the board
tNames: MINISUMO_EDU_1_V1.00
bNames: ZUBA-projects | MINISUMO_EDU_1 | V1.00 1.03.2020 By zuba1 | github.com/ZUBA-projects/MINISUMO_ROBOT